# EAGLE design bbf-thonkjacks (EAGLE 9.6.2)
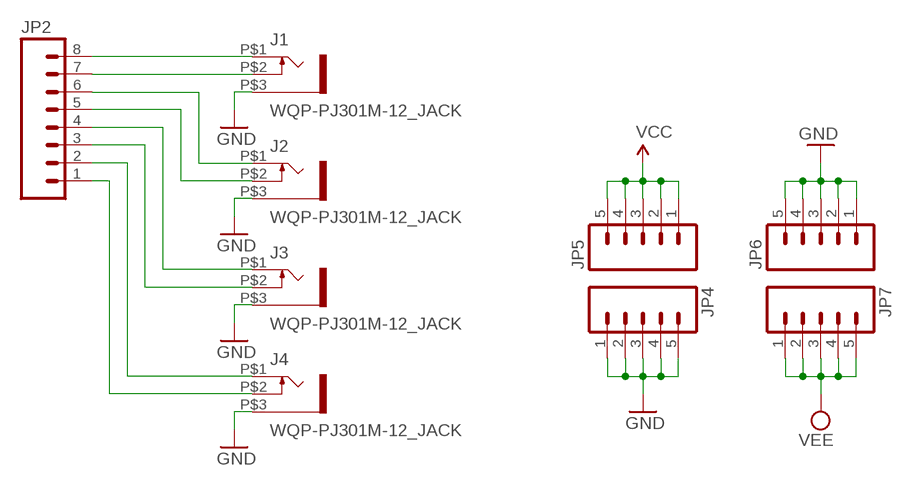
[diagram p0: schematic, sheet 1]

## Parts
J1  WQP-PJ301M-12_JACK  [WQP-PJ301M-12_JACK]
J2  WQP-PJ301M-12_JACK  [WQP-PJ301M-12_JACK]
J3  WQP-PJ301M-12_JACK  [WQP-PJ301M-12_JACK]
J4  WQP-PJ301M-12_JACK  [WQP-PJ301M-12_JACK]
JP2  M08  [1X08]
JP4  M05PTH  [1X05]
JP5  M05PTH  [1X05]
JP6  M05PTH  [1X05]
JP7  M05PTH  [1X05]

## Nets
GND: J1.P$3 J2.P$3 J3.P$3 J4.P$3 JP4.1 JP4.2 JP4.3 JP4.4 JP4.5 JP6.1 JP6.2 JP6.3 JP6.4 JP6.5
N$1: J2.P$1 JP2.6
N$2: J2.P$2 JP2.5
N$3: J3.P$1 JP2.4
N$4: J3.P$2 JP2.3
N$5: J4.P$1 JP2.2
N$6: J4.P$2 JP2.1
N$7: J1.P$1 JP2.8
N$8: J1.P$2 JP2.7
VCC: JP5.1 JP5.2 JP5.3 JP5.4 JP5.5
VEE: JP7.1 JP7.2 JP7.3 JP7.4 JP7.5

## Library data of the parts
J1-J4 = thonkiconn:WQP-PJ301M-12_JACK
JP2 = SparkFun:M08: Header 8 Standard 8-pin 0.1" header. Use with straight break away headers (SKU : PRT-00116), right angle break away headers (PRT-00553), swiss pins (PRT-00743), machine pins (PRT-00117), and female headers (PRT-00115).
JP4-JP7 = SparkFun:M05: Header 5 Standard 5-pin 0.1" header. Use with straight break away headers (SKU : PRT-00116), right angle break away headers (PRT-00553), swiss pins (PRT-00743), machine pins (PRT-00117), and female headers (PRT-00115). Molex polarized connector foot print use with SKU : PRT-08230 with associated crimp pins and housings.

## Board
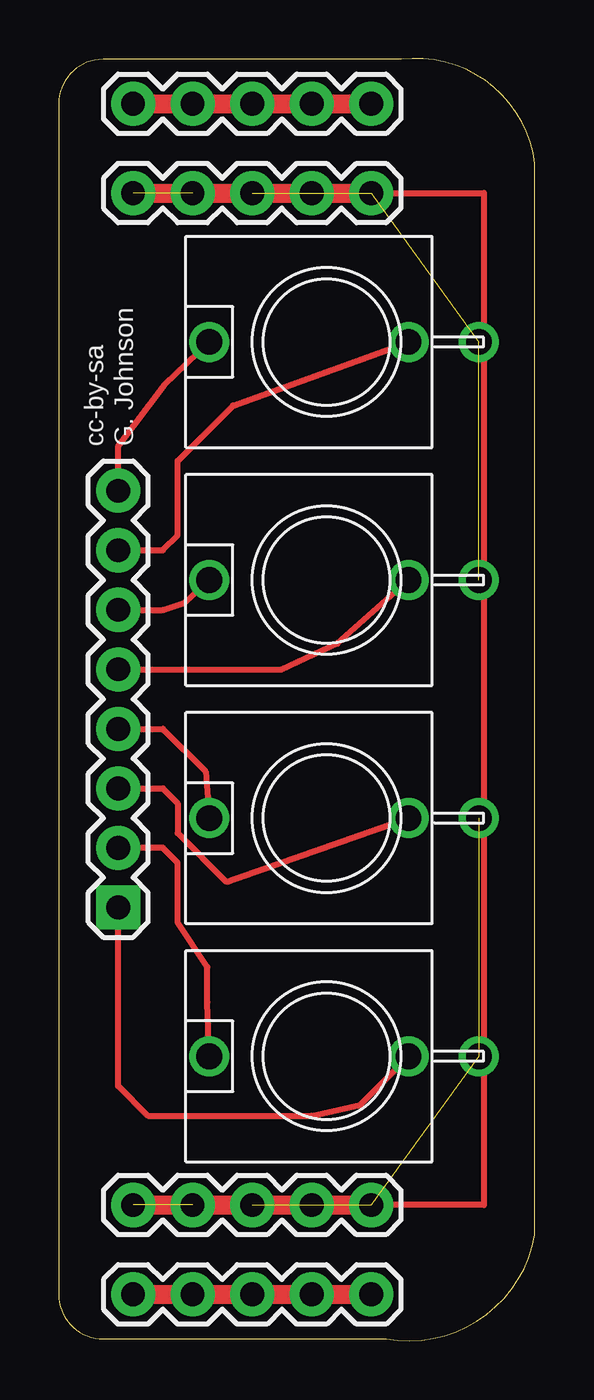
[diagram p1: board, top side]
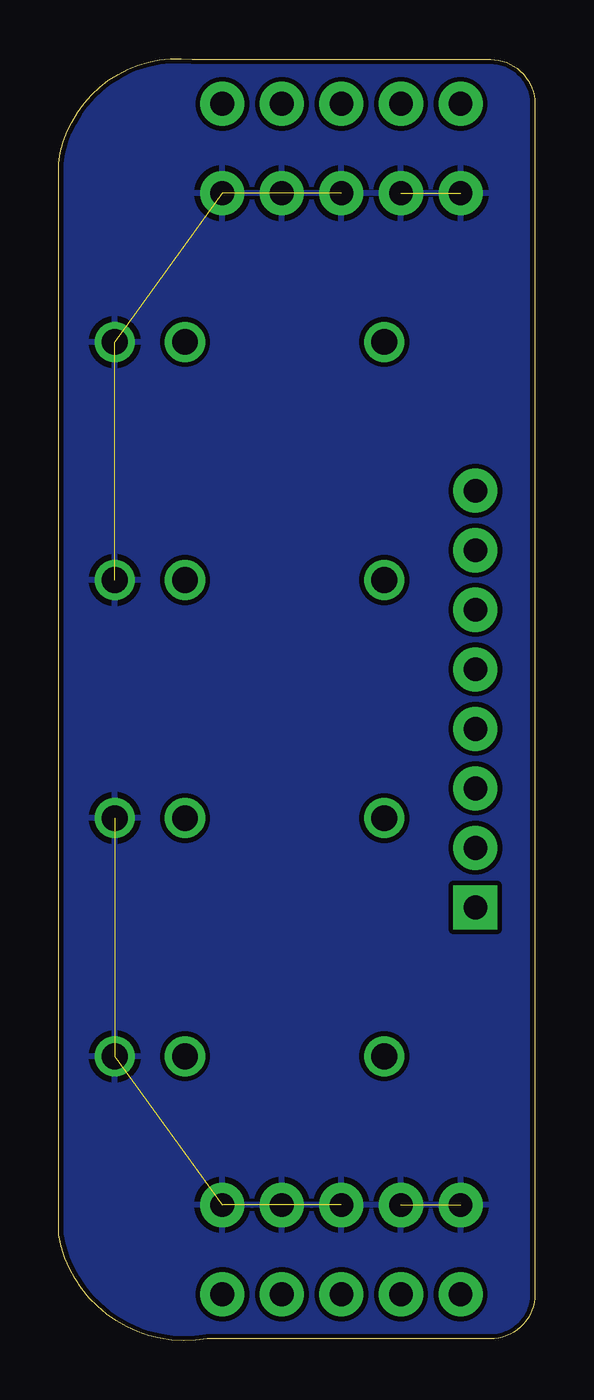
[diagram p2: board, bottom side, seen from below]

Size 20.32 x 54.72 mm. Coordinates in mm from the lower left corner, seen from the top.
Outline: 13.97,0.08 arc90 20.32,4.53 20.32,50.25 arc90 14.62,54.68 1.9,54.68 arc90 0,52.79 0,1.99 arc90 1.91,0.08 13.97,0.08
Copper layers (1*16): Top 0.035mm / dielectric 1.5mm / Bottom 0.035mm
Design rules "SparkFun_10mil *": minimum track width 8mil, minimum drill 20mil, track to track 8mil, track to pad 8mil, pad to pad 8mil, via to via 8mil, smd to smd 8mil, copper to edge 8mil, drill to drill 8mil, minimum pad ring 12mil, minimum via ring 10mil, stop-mask expansion 4mil, vias tented up to drill 25mil, thermal gap 10mil

### Footprints (pad centres in the part's own frame; a part is rotated, then mirrored left to right if it is on the bottom)
WQP-PJ301M-12_JACK = drill 1.1: P$1 0,5; P$2 0,-3.5; P$3 0,-6.5
1X08 = drill 1.016 pad 1.88 square: 1 0,0 | drill 1.016 pad 1.88: 2 2.54,0; 3 5.08,0; 4 7.62,0; 5 10.16,0; 6 12.7,0; 7 15.24,0; 8 17.78,0
1X05 = drill 1.016 pad 1.88: 1 0,0; 2 2.54,0; 3 5.08,0; 4 7.62,0; 5 10.16,0

### Placement (x,y rotation side)
J1  11.43,42.63 90 top
J2  11.43,32.47 90 top
J3  11.43,22.31 90 top
J4  11.43,12.15 90 top
JP2  2.54,18.5 90 top
JP4  3.17,48.98 0 top
JP5  3.17,52.79 0 top
JP6  3.17,5.8 0 top
JP7  3.17,1.99 0 top

### Tracks (layer width: path | path; a pad name or v marks a point on that pad's centre or on a via)
GND  (10 unrouted)
  Top 0.254: JP4.5 18.14,48.98 18.14,5.8 JP6.5
  Top 0.813: JP4.1 JP4.5 | JP6.1 JP6.5
  pour Bottom: 14.24,0.08 arc90 20.32,4.81 20.32,50.11 arc90 14.42,54.69 1.91,54.69 arc90 0,52.79 0,1.99 arc90 1.91,0.08
N$1
  Top 0.254: JP2.6 4.45,31.2 5.4,31.52 J2.P$1
N$2
  Top 0.254: JP2.5 9.53,28.66 11.89,29.75 J2.P$2
N$3
  Top 0.254: JP2.4 4.45,26.12 6.27,24.29 J3.P$1
N$4
  Top 0.254: JP2.3 4.45,23.58 5.08,22.94 5.08,21.67 7.16,19.59 J3.P$2
N$5
  Top 0.254: J4.P$1 6.35,14.45 6.35,15.96 5.08,17.86 5.08,20.4 4.45,21.04 JP2.2
N$6
  Top 0.254: JP2.1 2.54,10.88 3.81,9.61 10.79,9.61 12.88,10.07 J4.P$2
N$7
  Top 0.254: JP2.8 2.54,38.18 4.53,40.8 J1.P$1
N$8
  Top 0.254: JP2.7 4.45,33.74 5.08,34.37 5.08,37.55 7.45,39.91 J1.P$2
VCC
  Top 0.813: JP5.1 JP5.2 JP5.3 JP5.4 JP5.5
VEE
  Top 0.813: JP7.1 JP7.2 JP7.3 JP7.4 JP7.5

### Text on the board
tNames: cc-by-sa | G. Johnson